# Altium schematic sheet OK.SchDoc
size A4
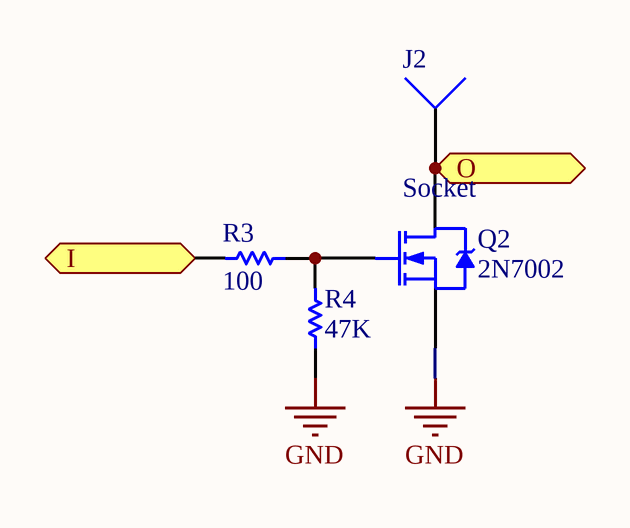
[diagram p0: OK.SchDoc]

## Parts
J2  Socket  [PIN#001]
Q2  2N7002  [SOT-23_N]
R3  value 100  [0603x]
R4  value 47K  [0603x]

## Ports
I, O

## Nets
GND: Q2.2(S) R4.1
I: R3.2 ; port I
O: J2.1 Q2.3(D) ; port O
NetQ2_1: Q2.1(G) R3.1 R4.2

## Library data of the parts
Q2 = IRLML2402: HEXFET Power MOSFET; Published: 8-Jun-2000; LatestRevisionDate: 20-Nov-2009; LatestRevisionNote: IPC-7351 Footprint Added.; DatasheetVersion: Aug-1997; PackageReference: SOT-23; Publisher: Altium Limited; PackageDescription: 3-Pin SOT-23 Package 0.95 mm Pitch, 2.3 mm Lead Span; ComponentLink1Description: Manufacturer Link; ComponentLink1URL: http://www.irf.com/; ComponentLink2Description: Datasheet; ComponentLink2URL: http://www.irf.com/product-info/datasheets/data/irlml2402.pdf
R3 R4 = Res1: Resistor; Published: 8-Jun-2000; LatestRevisionDate: 17-Jul-2002; LatestRevisionNote: Re-released for DXP Platform.; PackageReference: AXIAL-0.3; Publisher: Altium Limited; PackageDescription: Axial Device, Thru-Hole; 2 Leads; 0.3 in Pin Spacing
J2 = Socket: LatestRevisionDate: 17-Jul-2002; LatestRevisionNote: Re-released for DXP Platform.; Publisher: Altium Limited